# Altium schematic sheet G2-PMS.SchDoc
size A2; Revision: 4; SheetNumber: 2; SheetTotal: 4
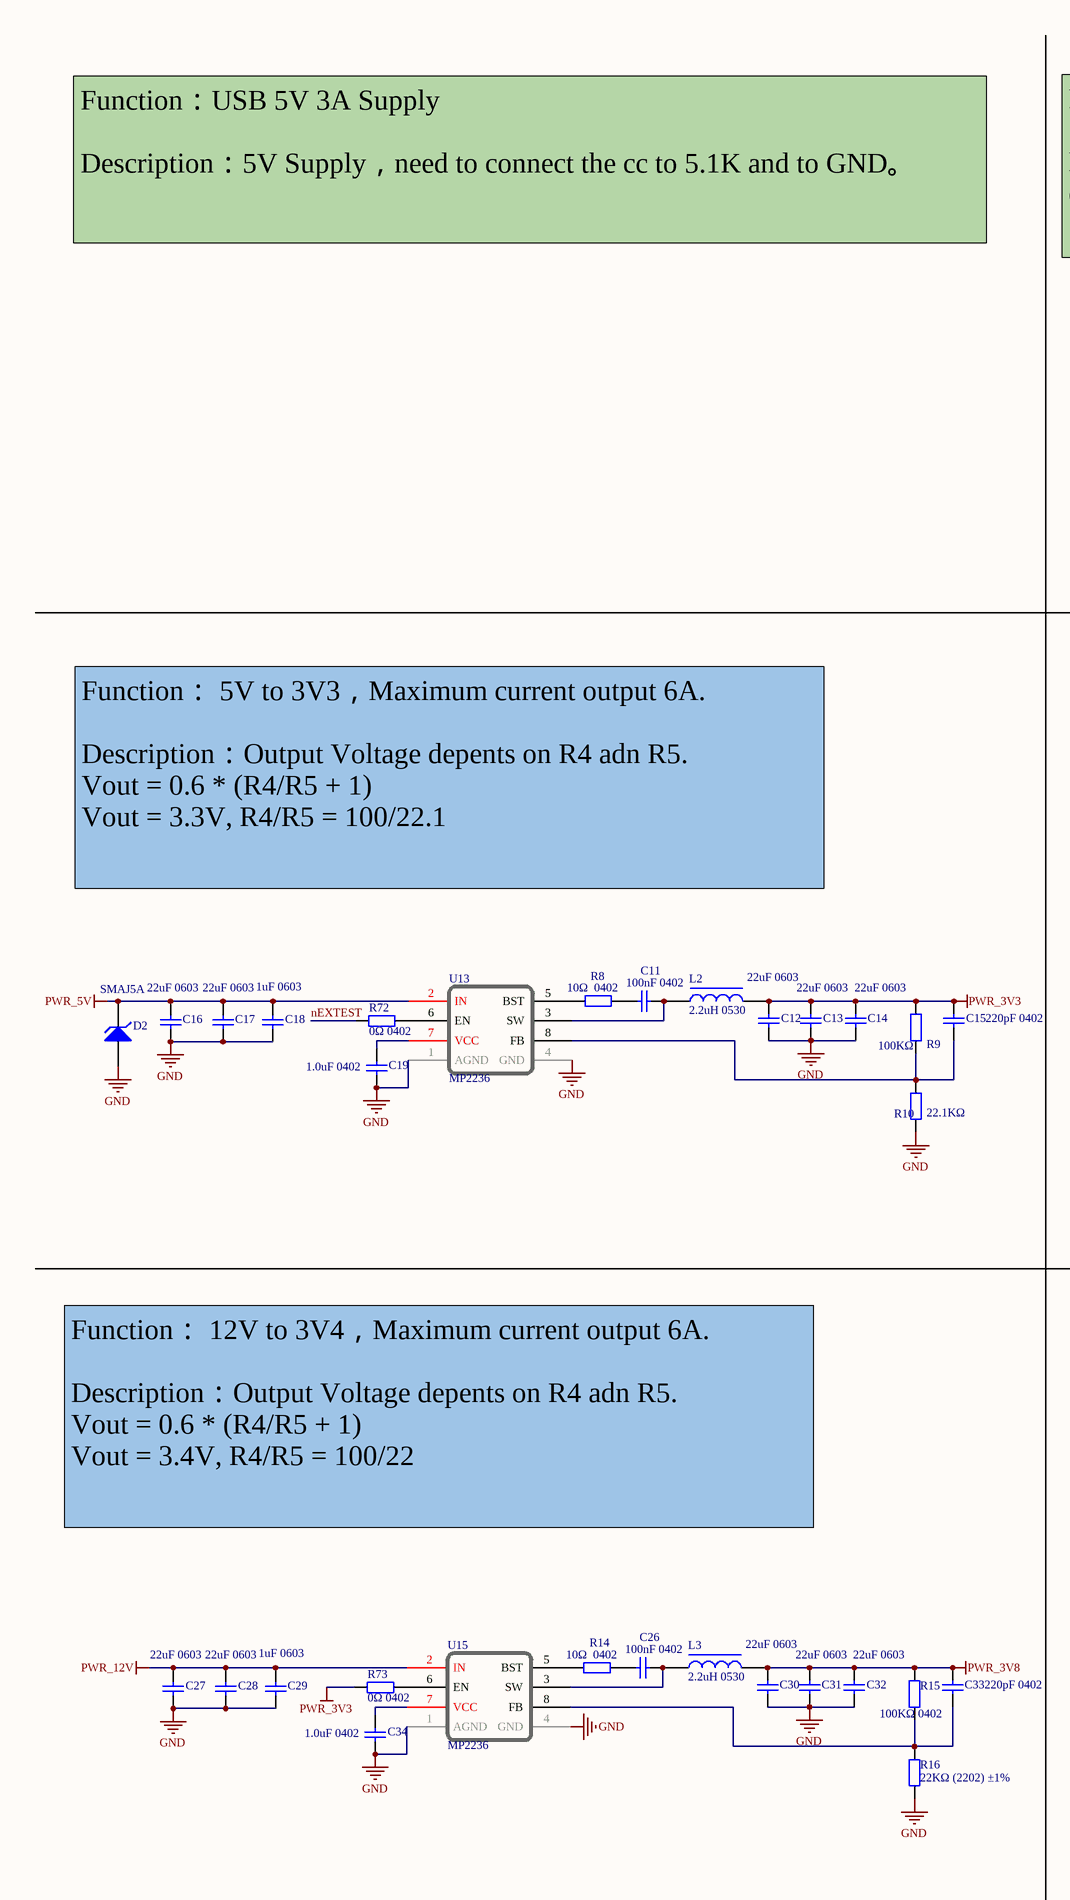
[diagram p0: G2-PMS.SchDoc, left]
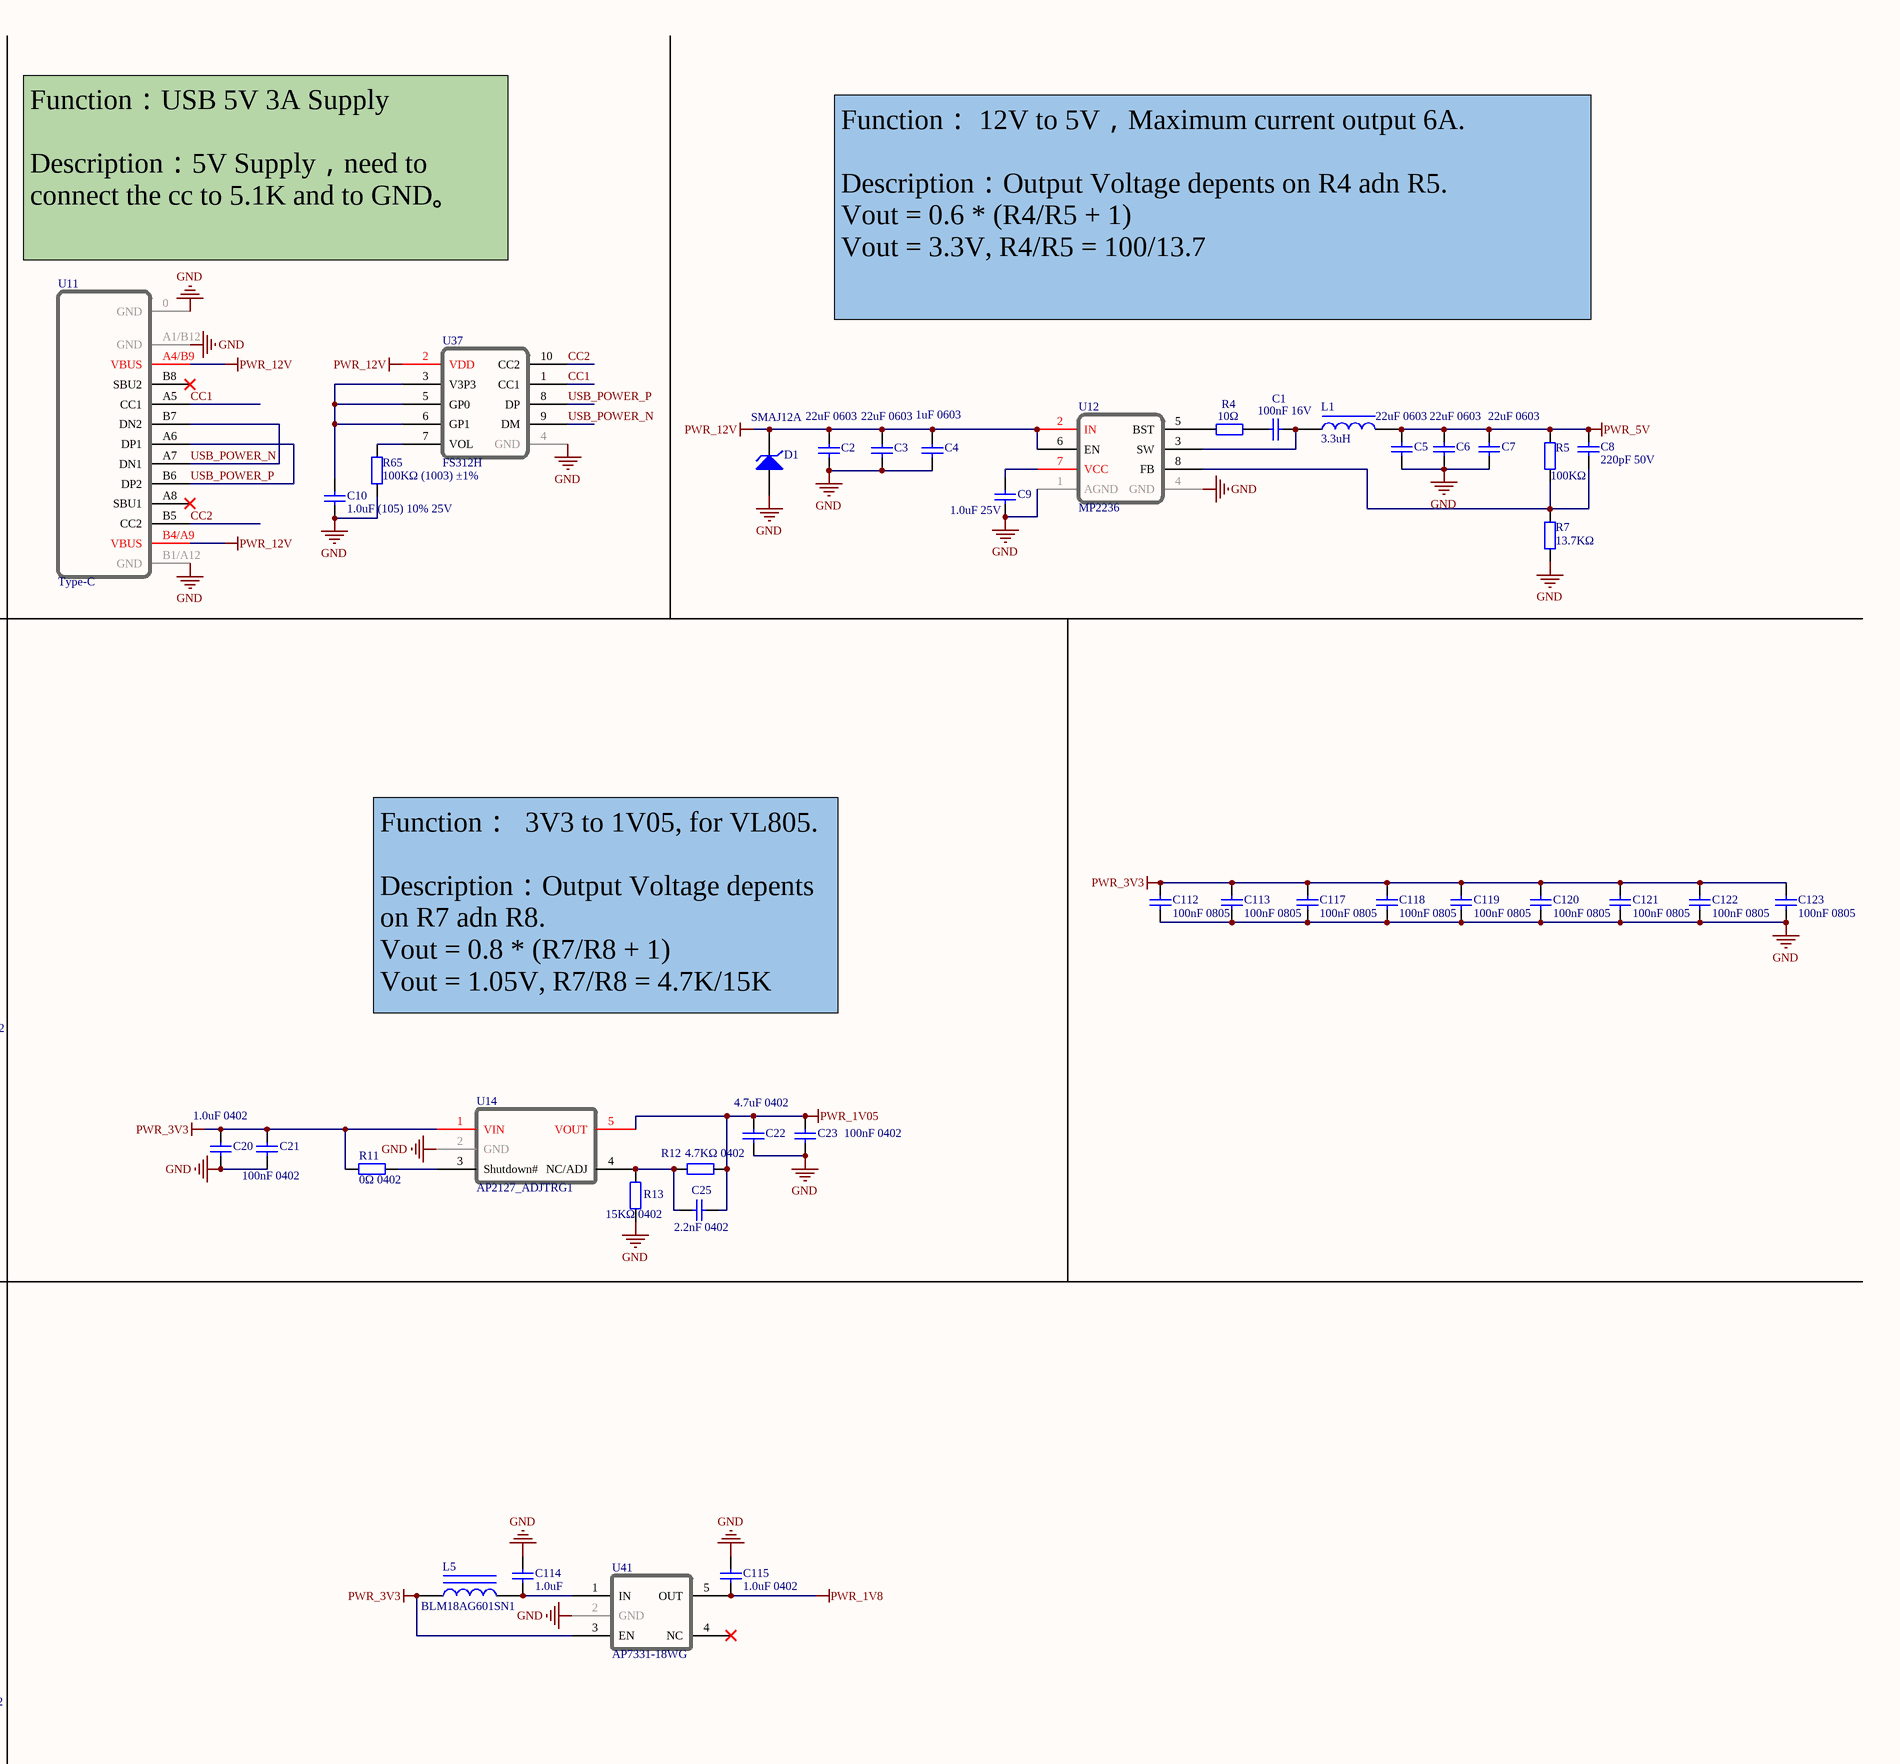
[diagram p1: G2-PMS.SchDoc, right]

## Parts
C1  100nF 16V  [0402_C]
C2  22uF 0603  [0603_C]
C3  22uF 0603  [0603_C]
C4  1uF 0603  [0603_C]
C5  22uF 0603  [0603_C]
C6  22uF 0603  [0603_C]
C7  22uF 0603  [0603_C]
C8  220pF 50V  [0402_C]
C9  1.0uF 25V  [0402_C]
C10  1.0uF (105) 10% 25V  [0402_C]
C11  100nF 0402  [0402_C]
C12  22uF 0603  [0603_C]
C13  22uF 0603  [0603_C]
C14  22uF 0603  [0603_C]
C15  220pF 0402  [0402_C]
C16  22uF 0603  [0603_C]
C17  22uF 0603  [0603_C]
C18  1uF 0603  [0603_C]
C19  1.0uF 0402  [0402_C]
C20  1.0uF 0402  [0402_C]
C21  100nF 0402  [0402_C]
C22  4.7uF 0402  [0402_C]
C23  100nF 0402  [0402_C]
C25  2.2nF 0402  [0402_C]
C26  100nF 0402  [0402_C]
C27  22uF 0603  [0603_C]
C28  22uF 0603  [0603_C]
C29  1uF 0603  [0603_C]
C30  22uF 0603  [0603_C]
C31  22uF 0603  [0603_C]
C32  22uF 0603  [0603_C]
C33  220pF 0402  [0402_C]
C34  1.0uF 0402  [0402_C]
C112  100nF 0805  [0805_C]
C113  100nF 0805  [0805_C]
C114  1.0uF  [0402_C]
C115  1.0uF 0402  [0402_C]
C117  100nF 0805  [0805_C]
C118  100nF 0805  [0805_C]
C119  100nF 0805  [0805_C]
C120  100nF 0805  [0805_C]
C121  100nF 0805  [0805_C]
C122  100nF 0805  [0805_C]
C123  100nF 0805  [0805_C]
D1  SMAJ12A  [SMAJ12A]
D2  SMAJ5A  [SMAJ5A]
L1  3.3uH  [0530]
L2  2.2uH 0530  [0530]
L3  2.2uH 0530  [0530]
L5  BLM18AG601SN1  [0603_L]
R4  10Ω  [0402_R]
R5  100KΩ  [0402_R]
R7  13.7KΩ  [0402_R]
R8  10Ω  0402  [0402_R]
R9  100KΩ  [0402_R]
R10  22.1KΩ  [0402_R]
R11  0Ω 0402  [0402_R]
R12  4.7KΩ 0402  [0402_R]
R13  15KΩ 0402  [0402_R]
R14  10Ω  0402  [0402_R]
R15  100KΩ 0402  [0402_R]
R16  22KΩ (2202) ±1%  [0402_R]
R65  100KΩ (1003) ±1%  [0402_R]
R72  0Ω 0402  [0402_R]
R73  0Ω 0402  [0402_R]
U11  Type-C  [Type-C-16P]
U12  MP2236  [MP2236]
U13  MP2236  [MP2236]
U14  AP2127_ADJTRG1  [AP2127K]
U15  MP2236  [MP2236]
U37  FS312H  [FS312H]
U41  AP7331-18WG  [AP7331-18WG]

## Nets
GND: C2.1 C3.1 C4.1 C5.1 C6.1 C7.1 C9.1 C10.1 C12.1 C13.1 C14.1 C16.1 C17.1 C18.1 C19.1 C20.1 C21.1 C22.1 C23.1 C27.1 C28.1 C29.1 C30.1 C31.1 C32.1 C34.1 C112.1 C113.1 C114.2 C115.1 C117.1 C118.1 C119.1 C120.1 C121.1 C122.1 C123.1 D1.1(A) D2.1(A) R7.1 R10.1 R13.1 R16.1 R65.1 U11.0(GND) U11.A1/B12(GND) U11.B1/A12(GND) U12.1(AGND) U12.4(GND) U13.1(AGND) U13.4(GND) U14.2(GND) U15.1(AGND) U15.4(GND) U37.4(GND) U41.2(GND)
PWR_1V05: C22.2 C23.2 C25.2 R12.2 U14.5(VOUT)
PWR_1V8: C115.2 U41.5(OUT)
PWR_3V3: C12.2 C13.2 C14.2 C15.2 C20.2 C21.2 C112.2 C113.2 C117.2 C118.2 C119.2 C120.2 C121.2 C122.2 C123.2 L2.2 L5.1 R9.2 R11.1 R73.1 U14.1(VIN) U41.3(EN)
PWR_3V8: C30.2 C31.2 C32.2 C33.2 L3.2 R15.2
PWR_5V: C5.2 C6.2 C7.2 C8.2 C16.2 C17.2 C18.2 D2.2(C) L1.2 R5.2 U13.2(IN)
PWR_12V: C2.2 C3.2 C4.2 C27.2 C28.2 C29.2 D1.2(C) U11.A4/B9(VBUS) U11.B4/A9(VBUS) U12.2(IN) U12.6(EN) U15.2(IN) U37.2(VDD)
CC1: U11.A5(CC1) U37.1(CC1)
CC2: U11.B5(CC2) U37.10(CC2)
nEXTEST: R72.1
USB_POWER_N: U11.A7(DN1) U11.B7(DN2) U37.9(DM)
USB_POWER_P: U11.A6(DP1) U11.B6(DP2) U37.8(DP)
NetC1_1: C1.1 R4.2
NetC1_2: C1.2 L1.1 U12.3(SW)
NetC8_1: C8.1 R5.1 R7.2 U12.8(FB)
NetC9_2: C9.2 U12.7(VCC)
NetC10_2: C10.2 U37.3(V3P3) U37.5(GP0) U37.6(GP1)
NetC11_1: C11.1 R8.2
NetC11_2: C11.2 L2.1 U13.3(SW)
NetC15_1: C15.1 R9.1 R10.2 U13.8(FB)
NetC19_2: C19.2 U13.7(VCC)
NetC25_1: C25.1 R12.1 R13.2 U14.4(NC/ADJ)
NetC26_1: C26.1 R14.2
NetC26_2: C26.2 L3.1 U15.3(SW)
NetC33_1: C33.1 R15.1 R16.2 U15.8(FB)
NetC34_2: C34.2 U15.7(VCC)
NetC114_1: C114.1 L5.2 U41.1(IN)
NetR4_1: R4.1 U12.5(BST)
NetR8_1: R8.1 U13.5(BST)
NetR11_2: R11.2 U14.3(Shutdown#)
NetR14_1: R14.1 U15.5(BST)
NetR65_2: R65.2 U37.7(VOL)
NetR72_2: R72.2 U13.6(EN)
NetR73_2: R73.2 U15.6(EN)

Not connected (* = marked no-connect by the designer): U11 A8(SBU1)* B8(SBU2)*; U41 4(NC)*

## Notes on the sheet
- Function：USB 5V 3A Supply
  Description：5V Supply，need to connect the cc to 5.1K and to GND。
- (near U11) Function：USB 5V 3A Supply
  Description：5V Supply，need to connect the cc to 5.1K and to GND。
- Function： 12V to 5V，Maximum current output 6A.
  Description：Output Voltage depents on R4 adn R5.
  Vout = 0.6 * (R4/R5 + 1)
  Vout = 3.3V, R4/R5 = 100/13.7
- Function： 5V to 3V3，Maximum current output 6A.
  Description：Output Voltage depents on R4 adn R5.
  Vout = 0.6 * (R4/R5 + 1)
  Vout = 3.3V, R4/R5 = 100/22.1
- Function：  3V3 to 1V05, for VL805.
  Description：Output Voltage depents on R7 adn R8.
  Vout = 0.8 * (R7/R8 + 1)
  Vout = 1.05V, R7/R8 = 4.7K/15K
- Function： 12V to 3V4，Maximum current output 6A.
  Description：Output Voltage depents on R4 adn R5.
  Vout = 0.6 * (R4/R5 + 1)
  Vout = 3.4V, R4/R5 = 100/22

## Library data of the parts
C1 C11 C21 C23 C26 = 0402 100nF (104) 10% 16V: 贴片电容; ComponentLink1Description: 供应商链接; ComponentLink1URL: http://www.szlcsc.com/product/details_1877.html; Package: 0402; Supplier: LC; SuppliersPartNumber: C1525
C2 C3 C5-C7 C12-C14 C16 C17 C27 C28 C30-C32 = 0603 22uF (226) 20% 6.3V: 贴片电容; ComponentLink1Description: 供应商链接; ComponentLink1URL: http://www.szlcsc.com/product/details_60514.html; Package: 0603; Supplier: LC; SuppliersPartNumber: C59461
C4 C18 C29 = 0603 1uF (105) 10% 50V: 贴片电容; ComponentLink1Description: 供应商链接; ComponentLink1URL: http://www.szlcsc.com/product/details_16531.html; Package: 0603; Supplier: LC; SuppliersPartNumber: C15849
C8 C15 C33 = 0402 220pF (221) 10% 50V: 贴片电容; ComponentLink1Description: 供应商链接; ComponentLink1URL: http://www.szlcsc.com/product/details_1882.html; Package: 0402; Supplier: LC; SuppliersPartNumber: C1530
C9 C10 C19 C20 C34 C114 C115 = 0402 1.0uF (105) 10% 25V: 贴片电容; ComponentLink1Description: 供应商链接; ComponentLink1URL: http://www.szlcsc.com/product/details_53938.html; Package: 0402; Supplier: LC; SuppliersPartNumber: C52923
C22 = 0402 4.7uF (475) 20% 10V: 贴片电容; ComponentLink1Description: 供应商链接; ComponentLink1URL: http://www.szlcsc.com/product/details_24469.html; Package: 0402; Supplier: LC; SuppliersPartNumber: C23733
C25 = 0402 2.2nF (222) 10% 50V: 贴片电容; ComponentLink1Description: 供应商链接; ComponentLink1URL: http://www.szlcsc.com/product/details_1883.html; Package: 0402; Supplier: LC; SuppliersPartNumber: C1531
C112 C113 C117-C123 = 0805 100nF(104) 10% 50V: 贴片电容; ComponentLink1Description: 供应商链接; ComponentLink1URL: http://www.szlcsc.com/product/details_50686.html; Package: 0805; Supplier: LC; SuppliersPartNumber: C49678
D1 = SMAJ12A: TVS
D2 = SMAJ5A: TVS
L1 = 3.3uH: 3.3uH 0630
L2 L3 = 2.2uH: 2.2uH 0630
L5 = 0603 10uH 10%: 贴片电感; ComponentLink1Description: 供应商链接; ComponentLink1URL: http://www.szlcsc.com/product/details_1387.html; Package: 0603; Supplier: LC; SuppliersPartNumber: C1035
R4 R8 R14 = 0402 10Ω (10R0) 1%: 贴片电阻; ComponentLink1Description: 供应商链接; ComponentLink1URL: http://www.szlcsc.com/product/details_25820.html; Package: 0402; Supplier: LC; SuppliersPartNumber: C25077
R5 R9 R15 R65 = 0402 100KΩ (1003) 1%: 贴片电阻; ComponentLink1Description: 供应商链接; ComponentLink1URL: http://www.szlcsc.com/product/details_26484.html; Package: 0402; Supplier: LC; SuppliersPartNumber: C25741
R7 R10 = 0402 10KΩ (1002) 1%: 贴片电阻; ComponentLink1Description: 供应商链接; ComponentLink1URL: http://www.szlcsc.com/product/details_26487.html; Package: 0402; Supplier: LC; SuppliersPartNumber: C25744
R11 R72 R73 = 0402 0Ω (0R0) 1%: 贴片电阻; ComponentLink1Description: 供应商链接; ComponentLink1URL: http://www.szlcsc.com/product/details_17853.html; Package: 0402; Supplier: LC; SuppliersPartNumber: C17168
R12 = 0402 4.7KΩ (4701) 1%: 贴片电阻; ComponentLink1Description: 供应商链接; ComponentLink1URL: http://www.szlcsc.com/product/details_26643.html; Package: 0402; Supplier: LC; SuppliersPartNumber: C25900
R13 = 0402 15KΩ (1502) 1%: 贴片电阻; ComponentLink1Description: 供应商链接; ComponentLink1URL: http://www.szlcsc.com/product/details_26499.html; Package: 0402; Supplier: LC; SuppliersPartNumber: C25756
R16 = 0402 22KΩ (2202) 1%: 贴片电阻; ComponentLink1Description: 供应商链接; ComponentLink1URL: http://www.szlcsc.com/product/details_26511.html; Package: 0402; Supplier: LC; SuppliersPartNumber: C25768
U11 = Type-C-16P
U12 U13 U15 = MP2236: Vin=18, Iout=6A
U14 = AP2127_ADJTRG1: 3.3V-1.05V
U37 = FS312H: USB POWER PD 20V
U41 = AP7331-18WG: Camera 1.8V